# EAGLE design 4_TTL (EAGLE 7.6.0)
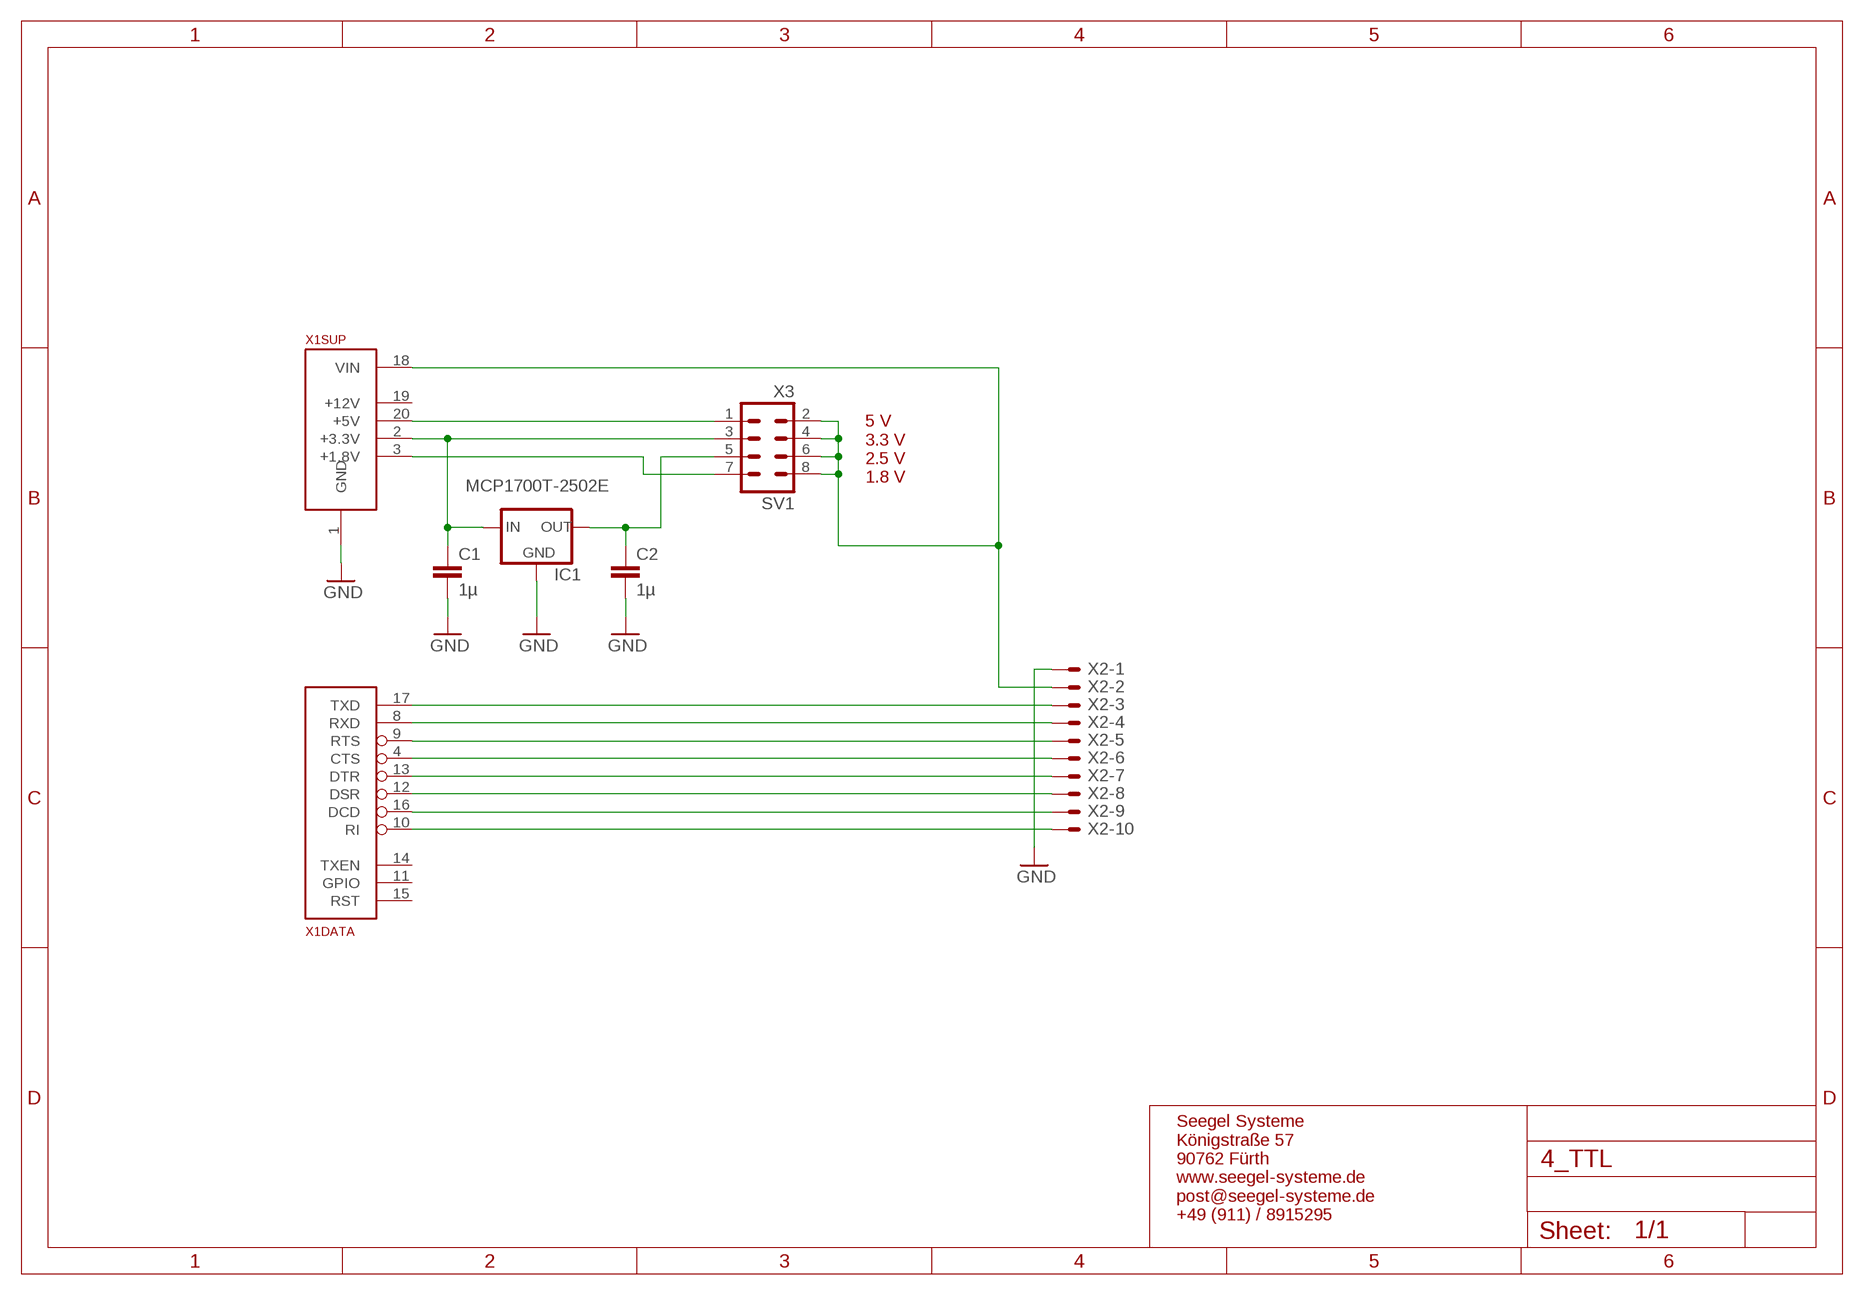
[diagram p0: schematic, sheet 1]

## Parts
C1  1µ  C-EUC0805K  [C0805K]
C2  1µ  C-EUC0805K  [C0805K]
IC1  MCP1700T-2502E  MCP170X  [SOT23]
SV1  X3  MA04-2W  [MA04-2W]
X1  ALLSERIALSLAVE  [DAUGHTER-THT]
X2  AKL18X-10W  [AKL182-10]

## Nets
CTS4: X1.4(DATA:CTS) X2.P$6
DCD4: X1.16(DATA:DCD) X2.P$9
DSR4: X1.12(DATA:DSR) X2.P$8
DTR4: X1.13(DATA:DTR) X2.P$7
GND: C1.2 C2.2 IC1.1(GND) X1.1(SUP:GND) X2.P$1
N$1: SV1.2 SV1.4 SV1.6 SV1.8 X1.18(SUP:VIN) X2.P$2
N$2: SV1.7 X1.3(SUP:+1.8V)
N$4: SV1.1 X1.20(SUP:+5V)
N$5: C1.1 IC1.3(IN) SV1.3 X1.2(SUP:+3.3V)
N$6: C2.1 IC1.2(OUT) SV1.5
RI4: X1.10(DATA:RI) X2.P$10
RTS4: X1.9(DATA:RTS) X2.P$5
RXD4: X1.8(DATA:RXD) X2.P$4
TXD4: X1.17(DATA:TXD) X2.P$3
Unconnected: X1.5(USB:D-) X1.6(USB:D+) X1.7(USB:VUSB) X1.11(DATA:GPIO) X1.14(DATA:TXEN) X1.15(DATA:RST) X1.19(SUP:+12V)

## Notes on the sheet
- 5 V
  3.3 V
  2.5 V
  1.8 V
- Seegel Systeme
  Königstraße 57
  90762 Fürth
  www.seegel-systeme.de
  post@seegel-systeme.de
  +49 (911) / 8915295

## Library data of the parts
C1 C2 = rcl:C-EU: CAPACITOR, European symbol
IC1 = SeeSys:MCP170X
SV1 = con-lstb:MA04-2: PIN HEADER
X1 = AllSerialv2:ALLSERIALSLAVE
X2 = con-riacon_akl:AKL18X-10: Riacon AKL18X Steckverbinder 10-Pol Grid = 3,5mm; OC_REICHELT: AKL 182-10

## Board
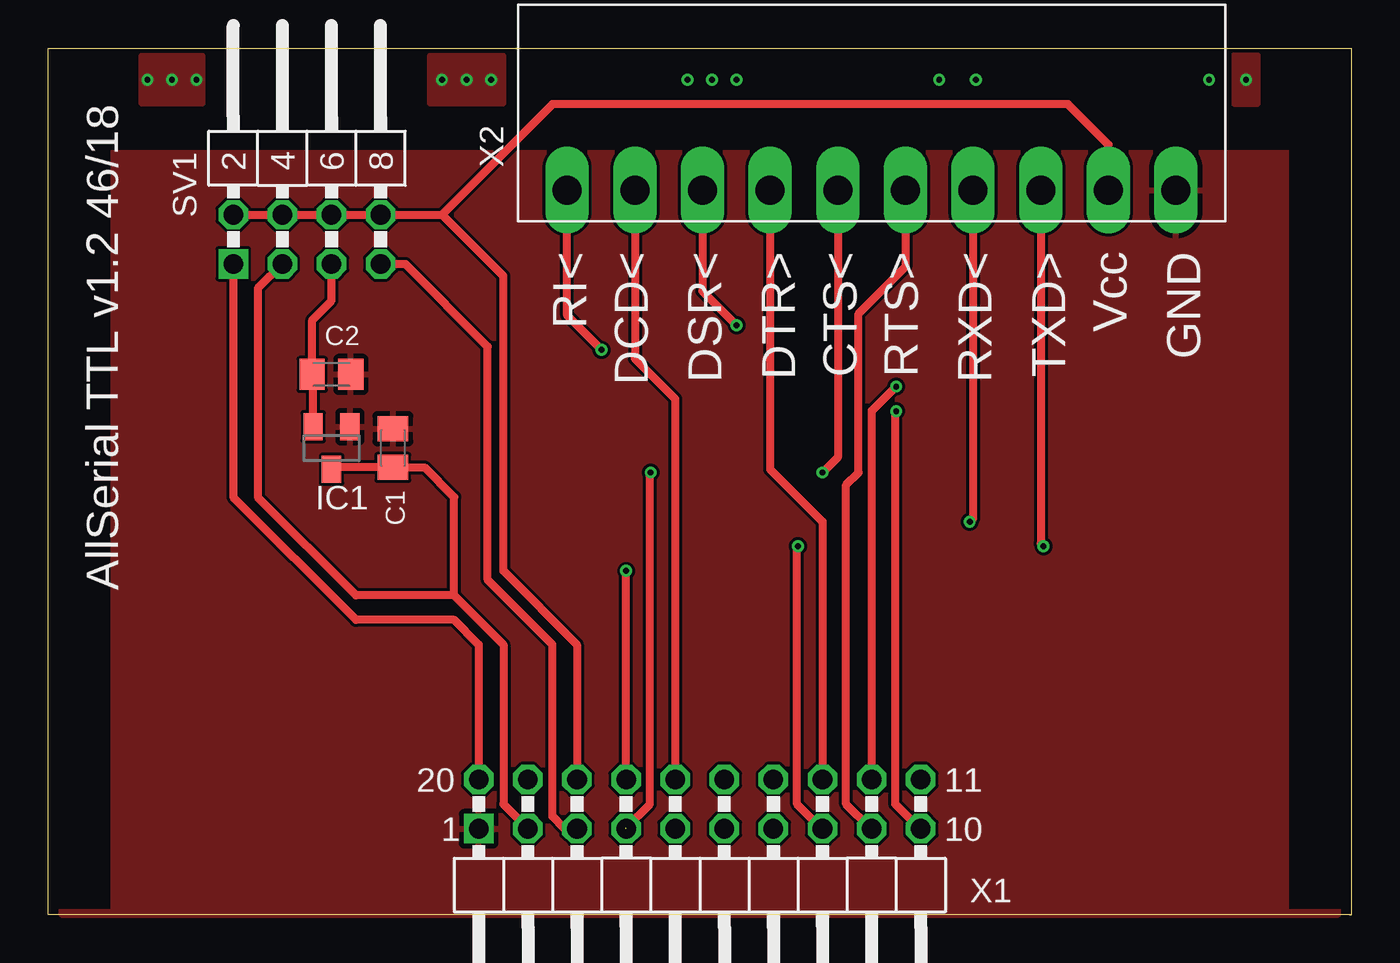
[diagram p1: board, top side]
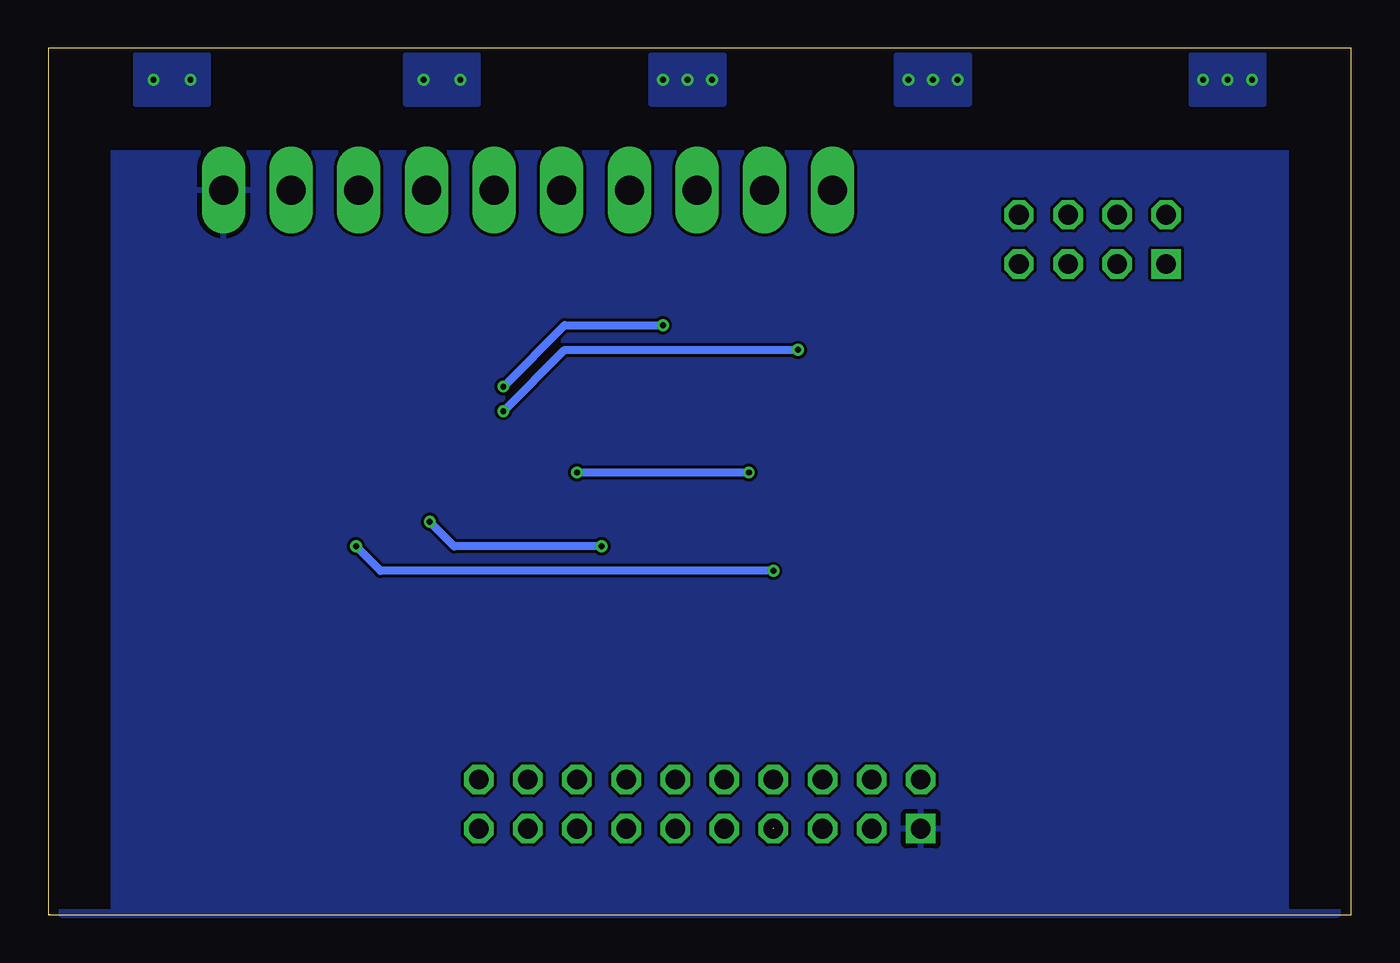
[diagram p2: board, bottom side, seen from below]

Size 67.4 x 44.8 mm. Coordinates in mm from the lower left corner, seen from the top.
Outline: 67.31,0 67.4,0
Copper layers (1*16): Top 0.035mm / dielectric 1.6mm / Bottom 0.035mm
Design rules "Elecrow_2-layer_PCB_eagle_rule *": minimum track width 6mil, minimum drill 0.3mm, track to track 6mil, track to pad 6mil, pad to pad 6mil, via to via 8mil, smd to smd 0mil, copper to edge 0mil, drill to drill 10mil, minimum pad ring 6mil, minimum via ring 6mil, stop-mask expansion 0mil, vias tented up to drill 0.3mm, thermal gap 10mil

### Footprints (pad centres in the part's own frame; a part is rotated, then mirrored left to right if it is on the bottom)
C0805K = smd 1.3 x 1.6: 1 -1,0; 2 1,0
SOT23 = smd 1 x 1.4: 1 -0.95,-1.1; 2 0.95,-1.1; 3 0,1.1
MA04-2W = drill 1.016 square: 1 -3.81,-1.27 | drill 1.016 octagon: 2 -3.81,1.27; 3 -1.27,-1.27; 4 -1.27,1.27; 5 1.27,-1.27; 6 1.27,1.27; 7 3.81,-1.27; 8 3.81,1.27
DAUGHTER-THT = drill 1.016 square: 1 -11.43,4.445 | drill 1.016 octagon: 2 -8.89,4.445; 3 -6.35,4.445; 4 -3.81,4.445; 5 -1.27,4.445; 6 1.27,4.445; 7 3.81,4.445; 8 6.35,4.445; 9 8.89,4.445; 10 11.43,4.445; 11 11.43,6.985; 12 8.89,6.985; 13 6.35,6.985; 14 3.81,6.985; 15 1.27,6.985; 16 -1.27,6.985; 17 -3.81,6.985; 18 -6.35,6.985; 19 -8.89,6.985; 20 -11.43,6.985
AKL182-10 = drill 1.5 pad 2.184 long: P$1 -15.75,0; P$2 -12.25,0; P$3 -8.75,0; P$4 -5.25,0; P$5 -1.75,0; P$6 1.75,0; P$7 5.25,0; P$8 8.75,0; P$9 12.25,0; P$10 15.75,0

### Placement (x,y rotation side)
C1  17.83,24.13 90 top
C2  14.65,27.94 0 top
IC1  14.65,24.13 180 top
SV1  13.38,34.92 0 top
X1  33.7,0 0 top
X2  42.59,37.47 180 top

### Tracks (layer width: path | path; a pad name or v marks a point on that pad's centre or on a via)
CTS4  (via drill 0.3)  (1 unrouted)
  Top 0.406: X2.P$6 40.84,23.65 v40.05,22.86 | 29.89,4.49 31.12,5.71 31.12,22.82 v31.16,22.86
  Bottom 0.406: v31.16,22.86 v40.05,22.86
DCD4
  Top 0.406: X2.P$9 30.34,28.76 32.43,26.67 X1.16
DSR4  (via drill 0.3)
  Top 0.406: X1.12 42.59,26.08 42.64,26.08 v43.86,27.3 | X2.P$8 33.84,32.24 v35.61,30.48
  Bottom 0.406: v43.86,27.3 40.69,30.48 v35.61,30.48
DTR4
  Top 0.406: X2.P$7 37.34,23.03 40.05,20.32 X1.13
GND
  pour Bottom: 0.68,39.37 66.72,39.37 66.72,0 0.68,0
  pour Top: 0.68,0 66.72,0 66.72,39.37 0.68,39.37
N$1
  Top 0.406: X1.18 27.35,13.97 23.54,17.78 23.54,33.02 20.37,36.2 | SV1.2 SV1.4 SV1.6 SV1.8 20.37,36.2 | X2.P$2 54.84,39.82 52.75,41.91 26.08,41.91 20.37,36.2
N$2
  Top 0.406: SV1.7 18.46,33.66 22.74,29.38 22.74,17.32 26.08,13.97 26.08,5.08 26.72,4.45 X1.3
N$3  (via drill 0.3)
  other vias: 34.34,43.18 33.07,43.18 35.61,43.18
  pour Bottom: 32.43,44.45 36.24,44.45 36.24,41.91 32.43,41.91
N$4
  Top 0.406: X1.20 22.27,13.97 21,15.24 15.92,15.24 9.57,21.59 SV1.1
N$5
  Top 0.406: IC1.3 14.75,23.13 C1.1 19.46,23.13 21,21.59 21,16.51 | 21,16.51 23.54,13.97 23.54,5.71 X1.2 | 21,16.51 15.92,16.51 10.84,21.59 10.84,32.38 SV1.3
N$6
  Top 0.406: IC1.2 13.7,27.89 C2.1 13.65,30.75 14.65,31.75 SV1.5
N$7  (via drill 0.3)
  other vias: 60.05,43.18 61.96,43.18
  pour Bottom: 62.91,41.91 59.1,41.91 59.1,44.45 62.91,44.45
  pour Top: 62.59,44.45 61.32,44.45 61.32,41.91 62.59,41.91
N$8  (via drill 0.3)
  other vias: 6.4,43.18 5.13,43.18 7.67,43.18
  pour Bottom: 4.49,44.45 8.3,44.45 8.3,41.91 4.49,41.91
  pour Top: 4.81,44.45 7.98,44.45 7.98,41.91 4.81,41.91
N$9  (via drill 0.3)
  other vias: 21.64,43.18 20.37,43.18 22.91,43.18
  pour Bottom: 19.73,44.45 23.54,44.45 23.54,41.91 19.73,41.91
  pour Top: 19.73,44.45 23.54,44.45 23.54,41.91 19.73,41.91
N$10  (via drill 0.3)
  other vias: 46.08,43.18 47.99,43.18
  pour Bottom: 45.13,44.45 48.94,44.45 48.94,41.91 45.13,41.91
RI4  (via drill 0.3)
  Top 0.406: v28.62,29.21 26.84,30.99 X2.P$10 | v43.86,26.04 43.82,25.99 43.82,5.71 45.09,4.45 X1.10
  Bottom 0.406: v43.86,26.04 40.69,29.21 v28.62,29.21
RTS4
  Top 0.406: X2.P$5 44.34,33.5 41.91,31.07 41.91,22.86 41.28,22.23 41.28,5.71 42.55,4.45 X1.9
RXD4  (via drill 0.3)
  Top 0.406: X2.P$4 47.84,20.49 v47.67,20.32 | v38.78,19.05 38.73,19 38.73,5.71 40.01,4.45 X1.8
  Bottom 0.406: v38.78,19.05 46.4,19.05 v47.67,20.32
TXD4  (via drill 0.3)
  Top 0.406: X2.P$3 51.34,19.19 v51.48,19.05 | X1.17 v29.89,17.78
  Bottom 0.406: v29.89,17.78 50.21,17.78 v51.48,19.05

### Text on the board
tPlace: AllSerial TTL v1.2 46/18 | RI< | DCD< | DSR< | DTR> | CTS< | RTS> | RXD< | TXD> | Vcc | GND